# EAGLE design dcdr_3.3 (EAGLE 9.6.2)
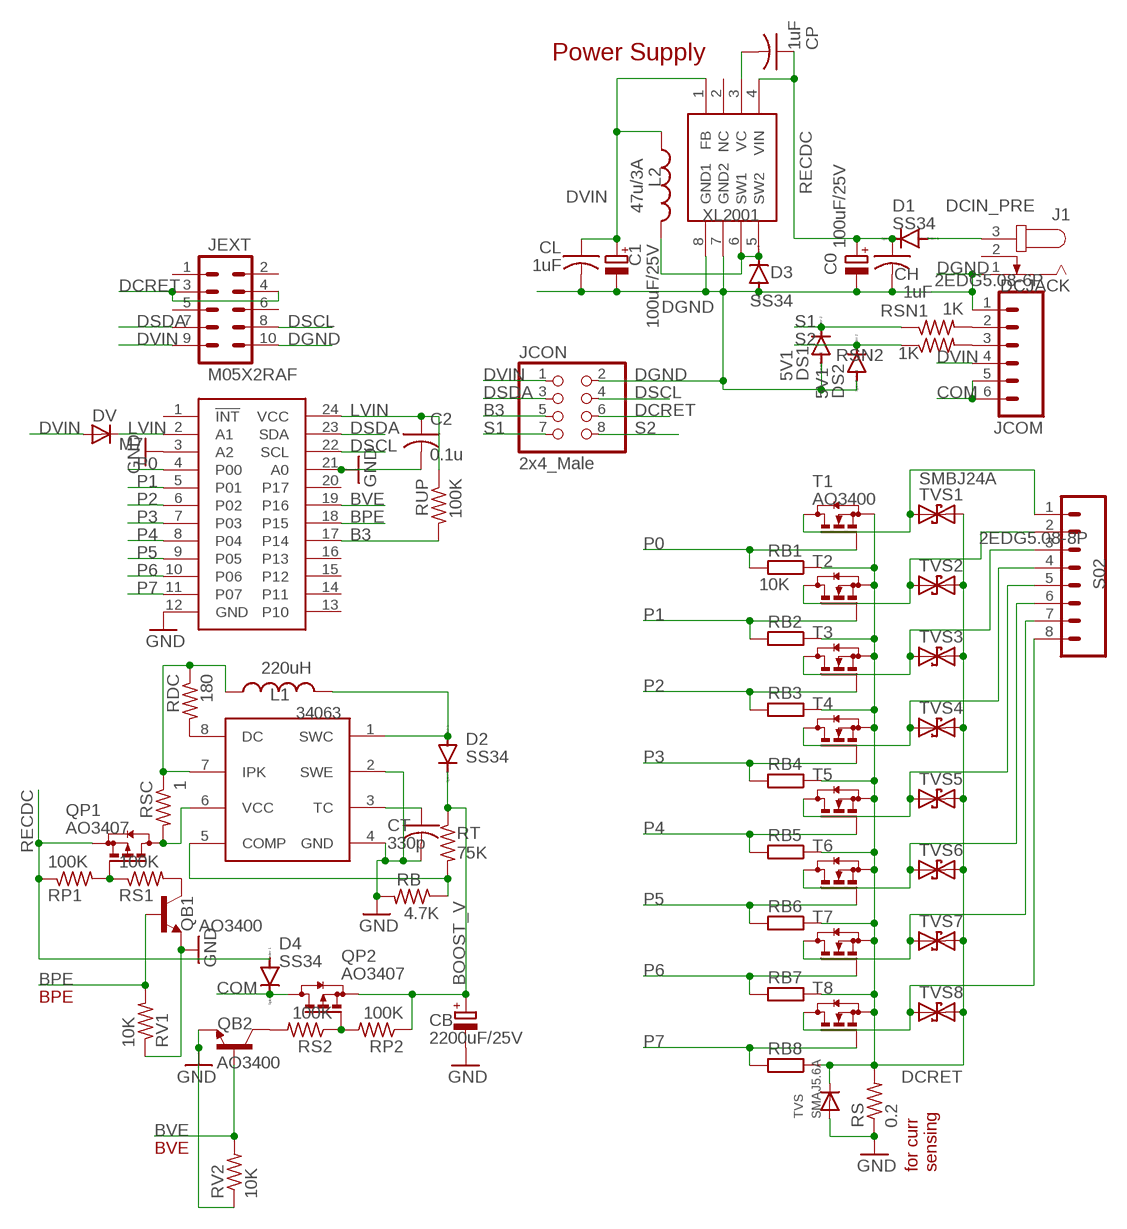
[diagram p0: schematic, sheet 1]

## Parts
34063  MC34063  MC33063/MC34063D  [SO08]
C0  100uF/25V  CPOL-EUE2-5  [E2-5]
C1  100uF/25V  CPOL-EUE2-5  [E2-5]
C2  0.1u  C-USC0603  [C0603]
CB  2200uF/25V  CPOL-EUE5-6  [E5-6]
CH  1uF  C-USC0603K  [C0603K]
CL  1uF  C-USC0603K  [C0603K]
CP  1uF  C-USC0603K  [C0603K]
CT  330p  C-USC0603K  [C0603K]
D1  SS34  DIODE-SMB  [SMB]
D2  SS34  DIODE-SMB  [SMB]
D3  SS34  DIODE-SMB  [SMB]
D4  SS34  DIODE-SMB  [SMB]
DS1  5V1  DIODE-MINIMELF  [MINIMELF]
DS2  5V1  DIODE-MINIMELF  [MINIMELF]
DV  M7  DIODESMA  [SMA-DIODE]
J1  DCJACK  JACK-PLUG0  [SPC4077]
JCOM  2EDG5.08-6P  M065MM  [SCREWTERMINAL-5MM-6]
JCON  2x4_Male  PINHD-2X4  [2X04]
JEXT  M05X2RAF  [2X5-RAF]
L1  220uH  INDUCTORCR54  [CR54]
L2  47u/3A  INDUCTORYT1014  [YT1014]
PCA9555  PCA9555  PCF8575TSSOP24  [TSSOP24]
QB1  AO3400  TRANSISTOR_NPNSOT23-3  [SOT23-3]
QB2  AO3400  TRANSISTOR_NPNSOT23-3  [SOT23-3]
QP1  AO3407  BSS84  [SOT23]
QP2  AO3407  BSS84  [SOT23]
RB  4.7K  R-US_R0603  [R0603]
RB1  10K  R-EU_R0603  [R0603]
RB2  10K  R-EU_R0603  [R0603]
RB3  10K  R-EU_R0603  [R0603]
RB4  10K  R-EU_R0603  [R0603]
RB5  10K  R-EU_R0603  [R0603]
RB6  10K  R-EU_R0603  [R0603]
RB7  10K  R-EU_R0603  [R0603]
RB8  10K  R-EU_R0603  [R0603]
RDC  180  R-US_R0603  [R0603]
RP1  100K  R-US_R0603  [R0603]
RP2  100K  R-US_R0603  [R0603]
RS  0.2  R-US_R2512  [R2512]
RS1  100K  R-US_R0603  [R0603]
RS2  100K  R-US_R0603  [R0603]
RSC  1  R-US_R0603  [R0603]
RSN1  1K  R-US_R0603  [R0603]
RSN2  1K  R-US_R0603  [R0603]
RT  75K  R-US_R0603  [R0603]
RUP  100K  R-US_R0603  [R0603]
RV1  10K  R-US_R0603  [R0603]
RV2  10K  R-US_R0603  [R0603]
S02  2EDG5.08-8P  M085MM-8  [SCREWTERMINAL-5MM-8]
T1  AO3400  BSS123  [SOT23]
T2  AO3400  BSS123  [SOT23]
T3  AO3400  BSS123  [SOT23]
T4  AO3400  BSS123  [SOT23]
T5  AO3400  BSS123  [SOT23]
T6  AO3400  BSS123  [SOT23]
T7  AO3400  BSS123  [SOT23]
T8  AO3400  BSS123  [SOT23]
TVS  SMAJ5.6A  DIODESMA  [SMADIODE]
TVS1  SMBJ24A  TVSSMB  [SMB]
TVS2  SMBJ24A  TVSSMB  [SMB]
TVS3  SMBJ24A  TVSSMB  [SMB]
TVS4  SMBJ24A  TVSSMB  [SMB]
TVS5  SMBJ24A  TVSSMB  [SMB]
TVS6  SMBJ24A  TVSSMB  [SMB]
TVS7  SMBJ24A  TVSSMB  [SMB]
TVS8  SMBJ24A  TVSSMB  [SMB]
XL2001  XL2001  [SO08]

## Nets
B3: JCON.5 PCA9555.17(P14) RUP.2
BOOST_V: CB.+ D2.C QP2.2(S) RP2.1 RT.1
BPE: PCA9555.18(P15) QB1.1(B) RV1.2
BVE: PCA9555.19(P16) QB2.1(B) RV2.2
COM [power]: D4.C JCOM.5 JCOM.6 QP2.3(D)
DCIN_PRE: D1.A J1.3
DCRET: JCON.6 JEXT.3 JEXT.4 RB1.1 RB2.1 RB3.1 RB4.1 RB5.1 RB6.1 RB7.1 RB8.1 RS.2 T1.2(S) T2.2(S) T3.2(S) T4.2(S) T5.2(S) T6.2(S) T7.2(S) T8.2(S) TVS1.C TVS2.C TVS3.C TVS4.C TVS5.C TVS6.C TVS7.C TVS8.C TVS.C
DGND [power]: 34063.2(SWE) 34063.4(GND) C0.- C1.- C2.2 CB.- CH.2 CL.2 CT.2 D3.A DS1.A DS2.A J1.1 JCOM.1 JCON.2 JEXT.10 PCA9555.3(A2) PCA9555.12(GND) PCA9555.21(A0) QB1.2(E) QB2.2(E) RB.2 RS.1 RV1.1 RV2.1 TVS.A XL2001.7(GND2) XL2001.8(GND1) ; supply symbol labelled GND
DSCL [i2c]: JCON.4 JEXT.8 PCA9555.22(SCL)
DSDA [i2c]: JCON.3 JEXT.7 PCA9555.23(SDA)
DVIN [power]: C1.+ CL.1 DV.A JCOM.4 JCON.1 JEXT.9 L2.P$2 XL2001.1(FB)
LVIN [power]: C2.1 DV.C PCA9555.2(A1) PCA9555.24(VCC) RUP.1
N$1: 34063.1(SWC) D2.A L1.P$2
N$2: JCOM.2 RSN1.2
N$3: JCOM.3 RSN2.2
N$4: D3.C L2.P$1 XL2001.5(SW2) XL2001.6(SW1)
N$17: 34063.3(TC) CT.1
N$24: 34063.8(DC) RDC.2
N$25: CP.2 XL2001.3(VC)
N$26: 34063.7(IPK) L1.P$1 RDC.1 RSC.1
N$27: 34063.6(VCC) QP1.3(D) RSC.2
N$29: 34063.5(COMP) RB.1 RT.2
N$30: QP1.1(G) RP1.2 RS1.1
N$34: QB2.3(C) RS2.2
N$35: QB1.3(C) RS1.2
N$38: QP2.1(G) RP2.2 RS2.1
N$50 [power]: S02.1 T1.3(D) TVS1.A
N$51 [power]: S02.2 T2.3(D) TVS2.A
N$52 [power]: S02.3 T3.3(D) TVS3.A
N$53 [power]: S02.4 T4.3(D) TVS4.A
N$54 [power]: S02.5 T5.3(D) TVS5.A
N$55 [power]: S02.6 T6.3(D) TVS6.A
N$56 [power]: S02.7 T7.3(D) TVS7.A
N$57 [power]: S02.8 T8.3(D) TVS8.A
P0: PCA9555.4(P00) RB1.2 T1.1(G)
P1: PCA9555.5(P01) RB2.2 T2.1(G)
P2: PCA9555.6(P02) RB3.2 T3.1(G)
P3: PCA9555.7(P03) RB4.2 T4.1(G)
P4: PCA9555.8(P04) RB5.2 T5.1(G)
P5: PCA9555.9(P05) RB6.2 T6.1(G)
P6: PCA9555.10(P06) RB7.2 T7.1(G)
P7: PCA9555.11(P07) RB8.2 T8.1(G)
RECDC [power]: C0.+ CH.1 CP.1 D1.C D4.A QP1.2(S) RP1.1 XL2001.4(VIN)
S1 [i2c]: DS1.C JCON.7 RSN1.1
S2 [i2c]: DS2.C JCON.8 RSN2.1
Unconnected: J1.2 JEXT.1 JEXT.2 JEXT.5 JEXT.6 PCA9555.1(!INT) PCA9555.13(P10) PCA9555.14(P11) PCA9555.15(P12) PCA9555.16(P13) PCA9555.20(P17) XL2001.2(NC)

## Notes on the sheet
- Power Supply
- BPE
- BVE
- for curr
  sensing

## Library data of the parts
34063 = adafruit:MC33063/MC34063: MC33063 and MC34063 Basic DC/DC converter with internal power-NPN transistor, 100KHz, 1.5A peak switch current. 3-40 input/output.
C0 C1 CB = rcl:CPOL-EU: POLARIZED CAPACITOR, European symbol; SPICEPREFIX: C
C2 CH CL CP CT = adafruit:C-US: CAPACITOR, American symbol
D1-D4 = diode:DIODE-: DIODE
DS1 DS2 = diode@1:DIODE-: DIODE
DV = SparkFun:DIODE: Diode
J1 = jacks:JACK-PLUG: DC POWER JACK Power Jack, DC, Right Angle, Through Hole, Rated 5A at 16VDC, PC Terminals Distributor: Farnell (www.Farnell.de) Drawing: 84N1161.pdf / 84N1162.pdf Manufacturer: SPC Technology (www.spctechnology.com) Type: SPC4077 / SPC 4078; OC_FARNELL: unknown; OC_NEWARK: unknown
JCOM = SparkFun:M06: Header 6 Standard 6-pin 0.1" header. Use with straight break away headers (SKU : PRT-00116), right angle break away headers (PRT-00553), swiss pins (PRT-00743), machine pins (PRT-00117), and female headers (PRT-00115). Molex polarized connector foot print use with SKU : PRT-08094 with associated crimp pins and housings. NOTES ON THE VARIANTS LOCK and LOCK_LONGPADS... This footprint was designed to help hold the alignment of a through-hole component (i.e. 6-pin header) while soldering it into place. You may notice that each hole has been shifted either up or down by 0.005 of an inch from it's more standard position (which is a perfectly straight line). This slight alteration caused the pins (the squares in the middle) to touch the edges of the holes. Because they are alternating, it causes a "brace" to hold the component in place. 0.005 has proven to be the perfect amount of "off-center" position when using our standard breakaway headers. Although looks a little odd when you look at the bare footprint, once you have a header in there, the alteration is very hard to notice. Also, if you push a header all the way into place, it is covered up entirely on the bottom side. This idea of altering the position of holes to aid alignment will be further integrated into the Sparkfun Library for other footprints. It can help hold any component with 3 or more connection pins.
JCON = adafruit_3:PINHD-2X4: PIN HEADER
JEXT = SparkFunNew:M05X2: Header 5x2 Standard 10-pin dual row 0.1" header. Commonly used with AVR-ISP. Use with Spark Fun Electronics SKU: PRT-00778
L1 L2 = SparkFunNew:INDUCTOR: Inductors Basic Inductor/Choke - 0603 and 1206. Footprints are not proven and vary greatly between part numbers.
PCA9555 = SparkFunNew:PCF8575
QB1 QB2 = SparkFunNew:TRANSISTOR_NPN: Transistor NPN BJT configuration in SOT23 package. MMBT2222 is the common NPN we use. Double check BCE configuration again layout.
QP1 QP2 = transistors:BSS84: P-CHANNEL MOS FET
RB RDC RP1 RP2 RS1 RS2 RSC RT RUP RV1 RV2 = adafruitGood:R-US_: RESISTOR, American symbol
RB1-RB8 = rcl:R-EU_: RESISTOR, European symbol; SPICEPREFIX: R
RS = adafruit:R-US_: RESISTOR, American symbol
RSN1 RSN2 = adafruit2013:R-US_: RESISTOR, American symbol
S02 = SparkFun:M08: Header 8 Standard 8-pin 0.1" header. Use with straight break away headers (SKU : PRT-00116), right angle break away headers (PRT-00553), swiss pins (PRT-00743), machine pins (PRT-00117), and female headers (PRT-00115).
T1-T8 = transistors:BSS123: N-CHANNEL MOS FET
TVS = adafruit:DIODE: Diode
TVS1-TVS8 = SparkFunNew:TVS
XL2001 = adafruit:XL2001

## Net classes
0 default: width 0.203 mm, clearance 0.178 mm
1 power: width 0.203 mm, clearance 0.178 mm
2 relaypower: width 0.203 mm, clearance 0.178 mm
3 signal: width 0.203 mm, clearance 0.178 mm
4 adc: width 0.406 mm, clearance 0.178 mm
5 i2c: width 0.305 mm, clearance 0.178 mm

## Board
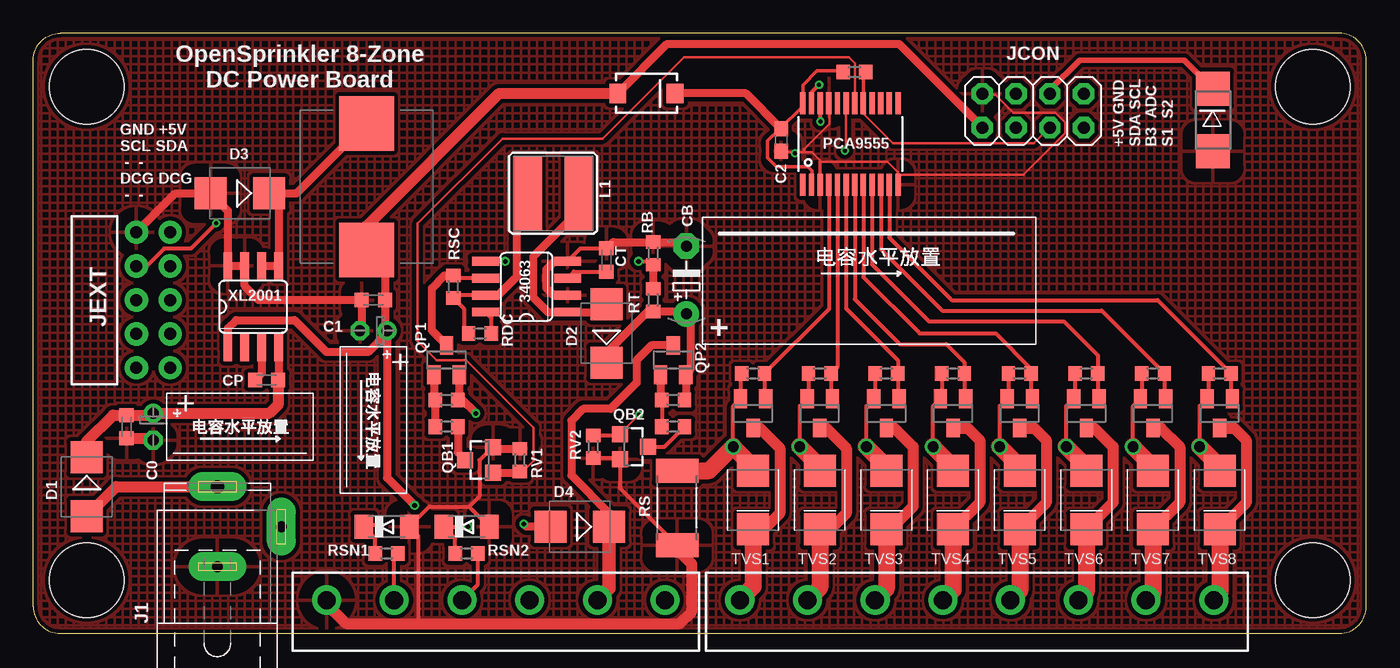
[diagram p1: board, top side]
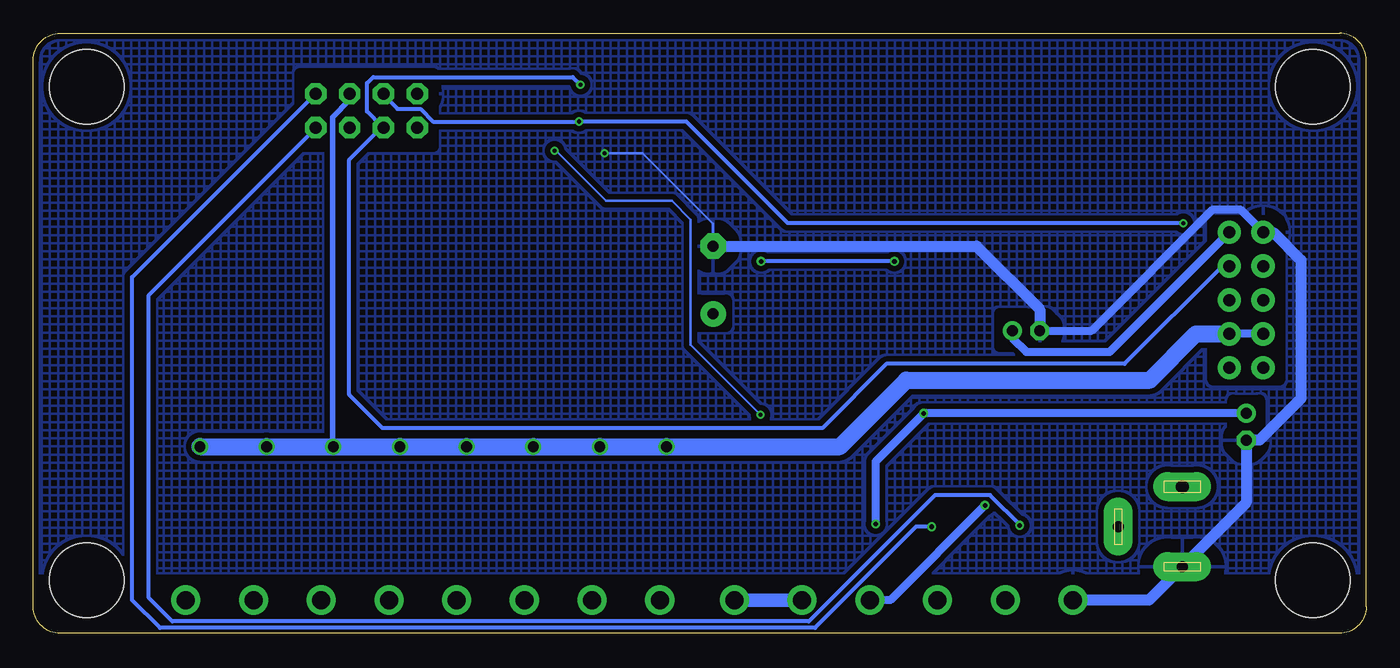
[diagram p2: board, bottom side, seen from below]

Size 100 x 45 mm. Coordinates in mm from the lower left corner, seen from the top.
Outline: 2,0 98,0 arc90 100,2 100,43 arc90 98,45 2,45 arc90 0,43 0,2 arc90 2,0
Copper layers (1*16): Top 0.035mm / dielectric 1.5mm / Bottom 0.035mm
Design rules "Fusion_eagle_rule_v1.1 *": minimum track width 6mil, minimum drill 12mil, track to track 6mil, track to pad 6mil, pad to pad 6mil, via to via 6mil, smd to smd 0mil, copper to edge 10mil, drill to drill 10mil, minimum pad ring 10mil, minimum via ring 6mil, stop-mask expansion 2mil, vias tented up to drill 100mil, thermal gap 40mil
Holes 5.6 mm at 4,4 96,4 4,41 96,41
bRestrict: area 70,36.5 to 80,42; area 6.5,19 to 11.5,31; area 48,23 to 50,25; area 8,15.5 to 10,17.5; area 25.5,21.5 to 27.5,24

### Footprints (pad centres in the part's own frame; a part is rotated, then mirrored left to right if it is on the bottom)
SO08 = smd 0.66 x 2.032: 1 -1.905,-3.073; 2 -0.635,-3.073; 3 0.635,-3.073; 4 1.905,-3.073; 5 1.905,3.073; 6 0.635,3.073; 7 -0.635,3.073; 8 -1.905,3.073
E2-5 = drill 0.813 pad 1.422: + -1.016,0 | drill 0.813 pad 1.422 octagon: - 1.016,0
C0603 = smd 1.1 x 1: 1 -0.85,0; 2 0.85,0
E5-6 = drill 0.813 pad 1.905: + -2.54,0 | drill 0.813 pad 1.905 octagon: - 2.54,0
C0603K = smd 1.05 x 1.08: 1 -0.875,0; 2 0.875,0
SMB = smd 2.4 x 2.4: A 2.2,0; C -2.2,0
MINIMELF = smd 1.4 x 1.8: A 1.7,0; C -1.7,0
SMA-DIODE = smd 1.27 x 1.47: A -2.15,0; C 2.15,0
SPC4077 = drill 0.8 pad 2.184 long: 1 -3,0; 2 0,-4.8 | drill 1 pad 2.184 long: 3 3,0
SCREWTERMINAL-5MM-6 = drill 1.35 pad 2.184: 1 0,0; 2 5.08,0; 3 10.16,0; 4 15.24,0; 5 20.32,0; 6 25.4,0
2X04 = drill 0.9 pad 1.6 octagon: 1 -3.81,-1.27; 2 -3.81,1.27; 3 -1.27,-1.27; 4 -1.27,1.27; 5 1.27,-1.27; 6 1.27,1.27; 7 3.81,-1.27; 8 3.81,1.27
2X5-RAF = drill 0.9 pad 1.75: 1 5.08,1.27; 2 5.08,-1.27; 3 2.54,1.27; 4 2.54,-1.27; 5 0,1.27; 6 0,-1.27; 7 -2.54,1.27; 8 -2.54,-1.27; 9 -5.08,1.27; 10 -5.08,-1.27
CR54 = smd 5.5 x 2.15: P$1 0,1.92; P$2 0,-1.92
YT1014 = smd 4.1 x 4.1: P$1 -4.75,0; P$2 4.75,0
TSSOP24 = smd 0.4 x 1.65: 1 -3.575,-3.05; 2 -2.925,-3.05; 3 -2.275,-3.05; 4 -1.625,-3.05; 5 -0.975,-3.05; 6 -0.325,-3.05; 7 0.325,-3.05; 8 0.975,-3.05; 9 1.625,-3.05; 10 2.275,-3.05; 11 2.925,-3.05; 12 3.575,-3.05; 13 3.575,3.05; 14 2.925,3.05; 15 2.275,3.05; 16 1.625,3.05; 17 0.975,3.05; 18 0.325,3.05; 19 -0.325,3.05; 20 -0.975,3.05; 21 -1.625,3.05; 22 -2.275,3.05; 23 -2.925,3.05; 24 -3.575,3.05
SOT23-3 = smd 1.2 x 1.2: 1 1,-0.95; 2 1,0.95; 3 -1.1,0
SOT23 = smd 1.4 x 1: 1 1.1,-0.95; 2 1.1,0.95; 3 -1.1,0
R0603 = smd 1 x 1.1: 1 -0.85,0; 2 0.85,0
R2512 = smd 1.8 x 3.2: 1 -2.8,0; 2 2.8,0
SCREWTERMINAL-5MM-8 = drill 1.35 pad 2.184: 1 0,0; 2 5.08,0; 3 10.16,0; 4 15.24,0; 5 20.32,0; 6 25.4,0; 7 30.48,0; 8 35.56,0
SMADIODE = smd 2.54 x 2.54: A 2.349,0; C -2.349,0

### Placement (x,y rotation side)
34063  37,26 90 top
C0  9,15.5 270 top
C1  25.52,22.7 180 top
C2  56.1,37 270 top
CB  49,26.5 90 top
CH  7,15.5 270 top
CL  25.5,25 180 top
CP  17.5,19 180 top
CT  43,28 90 top
D1  4,11 270 top
D2  43,22.5 90 top
D3  15.5,33 180 top
D4  41,8 180 top
DS1  26.5,8 0 top
DS2  32.5,8 0 top
DV  46,40.5 0 top
J1  13.8,8 90 top
JCOM  22,2.5 0 top
JCON  75,39.2 0 top
JEXT  9,25 270 top
L1  39,33 90 top
L2  25,33.5 270 top
PCA9555  61.3,36.7 0 top
QB1  33.5,13 0 top
QB2  45,14 180 top
QP1  31,20.5 270 top
QP2  48,20.5 270 top
RB  46.5,28.5 90 top
RB1  54,19.5 0 top
RB2  59,19.5 0 top
RB3  64,19.5 0 top
RB4  69,19.5 0 top
RB5  74,19.5 0 top
RB6  79,19.5 0 top
RB7  84,19.5 0 top
RB8  89,19.5 0 top
RDC  33.5,22.5 0 top
RP1  31,17.5 180 top
RP2  48,17.5 180 top
RS  48.3,9.4 90 top
RS1  31,15.5 0 top
RS2  48,15.5 0 top
RSC  31.5,26 90 top
RSN1  26.5,6 0 top
RSN2  32.5,6 0 top
RT  46.5,25 90 top
RUP  61.6,42.1 0 top
RV1  36.5,13 270 top
RV2  42,14 90 top
S02  53,2.5 0 top
T1  54,16.5 90 top
T2  59,16.5 90 top
T3  64,16.5 90 top
T4  69,16.5 90 top
T5  74,16.5 90 top
T6  79,16.5 90 top
T7  84,16.5 90 top
T8  89,16.5 90 top
TVS  88.5,38.5 270 top
TVS1  54,10 270 top
TVS2  59,10 270 top
TVS3  64,10 270 top
TVS4  69,10 270 top
TVS5  74,10 270 top
TVS6  79,10 270 top
TVS7  84,10 270 top
TVS8  89,10 270 top
XL2001  16.5,24.5 0 top

### Tracks (layer width: path | path; a pad name or v marks a point on that pad's centre or on a via)
B3
  Top 0.203: 62.51,42.06 RUP.2 | PCA9555.17 62.29,39.72 62.29,38.96 64.48,36.77 75.06,36.77 76.2,37.91 JCON.5
  Top 0.254: PCA9555.17 62.27,41.82 62.51,42.06
BOOST_V
  Top 0.61: D2.C 43,21.05 46.1,24.15 RT.1 48.81,24.15 CB.+ 49.3,23.66 49.3,19.75 QP2.2 48.95,17.6 RP2.1
BPE
  Top 0.203: RV1.2 36.74,12.15 37.54,12.95 37.54,15.42 32.48,20.48 30.27,20.48 28.84,21.91 28.84,30.74 35.2,37.1 42.7,37.1 48.8,43.2 61.2,43.2 61.62,42.77 PCA9555.18
  Top 0.61: QB1.1 36.4,12.05 RV1.2
BVE  (via drill 0.3)
  Top 0.203: v45.45,16.4 44.1,15.05 QB2.1 | v60.88,36.19 60.98,36.28 PCA9555.19
  Top 0.305: RV2.2 43.9,14.85 QB2.1
  Bottom 0.203: v60.88,36.19 60.8,36.19 57.04,32.43 52.09,32.43 50.69,31.04 50.69,21.64 v45.45,16.4
COM
  Top 0.61: QP2.3 46.37,21.6 45.27,20.5 45.27,18.79 43.31,16.83 41.25,16.83 40.37,15.95 40.37,11.85 43.2,9.02 D4.C
  Top 1.016: D4.C 43.2,3.38 JCOM.5
  Bottom 1.016: JCOM.5 JCOM.6
DCIN_PRE
  Top 0.813: D1.A 6.2,11 J1.3
DCRET  (via drill 0.8)
  Top 0.305: RB1.1 53.05,19.4 T1.2 52.5,17.05 v52.5,14 | RB2.1 58.15,17.7 T2.2 57.5,17.05 v57.5,14 | RB3.1 63.15,17.7 T3.2 62.5,17.05 v62.5,14 | RB4.1 68.15,17.7 T4.2 67.5,17.05 v67.5,14 | RB5.1 73.15,17.7 T5.2 72.5,17.05 v72.5,14 | RB6.1 78.15,17.7 T6.2 77.5,17.05 v77.5,14 | RB7.1 83.15,17.7 T7.2 82.5,17.05 v82.5,14 | RB8.1 88.15,17.7 T8.2 87.5,17.05 v87.5,14
  Top 0.406: JCON.6 76.27,40.77 78.5,43 86.35,43 TVS.C
  Top 1.27: TVS1.C 54,12.5 v52.5,14 50.7,12.2 RS.2 | TVS2.C 59,12.5 v57.5,14 | v62.5,14 64,12.5 TVS3.C | TVS4.C 69,12.5 v67.5,14 | v72.5,14 74,12.5 TVS5.C | TVS6.C 79,12.5 v77.5,14 | v82.5,14 84,12.5 TVS7.C | TVS8.C 89,12.5 v87.5,14
  Bottom 0.406: JCON.6 76.27,40 77.55,38.72 77.55,14
  Bottom 0.61: JEXT.4 JEXT.3
  Bottom 1.27: v87.5,14 v82.5,14 v77.5,14 | 77.55,14 v77.5,14 | v77.5,14 v72.5,14 v67.5,14 v62.5,14 v57.5,14 v52.5,14 39.5,14 34.5,19 16.23,19 12.77,22.46 JEXT.3
DGND  (via drill 0.3)
  Top 0.203: CT.2 43.01,28.86 43.12,28.98 | 57.82,36.1 58.4,36.1 59.02,35.48 59.02,35.37 64.08,35.37 64.86,34.59 64.86,33.72 PCA9555.12 64.96,34.38 74.3,34.38 77.44,37.53 77.44,38.29 76.68,39.05 73.53,39.05 72.2,40.39 71.25,40.39 JCON.2 | 57.82,36.1 57.15,36.1 | 57.15,36.1 56.1,36.1 C2.2 | PCA9555.21 59.72,39.72 59.72,38.2 57.82,36.3 57.82,36.1 | v57.15,36.01 57.15,36.1
  Top 0.254: PCA9555.3 59.02,35.37
  Top 0.305: 32.7,9.5 DS2.A | 32.7,9.5 29.7,9.5 DS1.A 28.9,7.3 28.9,2.31 28.9,0.72 | 32.7,9.5 33.47,10.27 33.47,12.99 34.43,13.95 QB1.2 | RV2.1 43.9,13.15 QB2.2 44,10.9 RS.1 | 34063.4 41.04,28.88 CT.2
  Top 0.406: 34063.2 39.03,25.36 | 39.1,27.91 34063.4 | 48.69,29.35 CB.-
  Top 0.61: C1.- 24.62,22.82 CL.2 16.9,25 15.87,26.04 XL2001.7 XL2001.8 14.6,31.7 D3.A 10.65,33 JEXT.10 | QB1.2 34.6,13.85 RV1.1 | 39.03,25.36 38.5,25.9 38.5,27.3 39.1,27.91 | 43.12,28.98 43.5,29.35 RB.2 48.69,29.35
  Top 0.813: CH.2 8.86,14.62 C0.- | JCOM.1 22,2.2 23.48,0.72 28.9,0.72 48.49,0.72 49.4,1.63 49.4,5.2 48.3,6.3 RS.1
  Bottom 0.203: v57.15,36.01 54.3,36.01 49,30.7 CB.-
  Bottom 0.61: C1.- 20.6,22.7 11.5,31.8 9.45,31.8 JEXT.10
  Bottom 0.813: JCOM.1 16.3,2.5 J1.1 9,9.8 C0.- 8.02,14.48 4.9,17.6 4.9,28 6.98,30.08 JEXT.10 | CB.- 29.24,29.04 24.5,24.3 C1.-
  pour Top (isolate 0.305, hatched): 0,45 100,45 100,0 0,0
  pour Bottom (isolate 0.406, hatched): 0,45 100,45 100,4.5 0,4.5
DSCL  (via drill 0.3)
  Top 0.305: v59.05,38.39 59.05,39.72 PCA9555.22 | v13.72,30.77 11.81,28.86 9.81,28.86 8.57,27.62 7.81,27.62 JEXT.8
  Bottom 0.305: JCON.4 73.72,40.39 72.68,39.34 70.96,39.34 70.01,38.39 v59.05,38.39 51.01,38.39 43.39,30.77 v13.72,30.77
DSDA  (via drill 0.3)
  Top 0.305: v58.96,41.15 58.39,40.58 58.39,39.81 PCA9555.23
  Bottom 0.305: v58.96,41.15 59.54,41.72 74.5,41.72 74.97,41.26 74.97,39.15 73.82,38.01 | 73.82,38.01 JCON.3 | JEXT.7 10.29,27.53 10.81,27.53 18.13,20.2 36,20.2 40.8,15.4 73.8,15.4 76.3,17.9 76.3,35.52 73.82,38.01
DVIN  (via drill 0.35)
  Top 0.203: 71.15,38.01 JCON.1
  Top 0.61: L2.P$2 26.38,27.38 CL.1 26.38,22.86 C1.+ | C1.+ 26.53,22.53 25.1,21.1 22,21.1 19.6,23.5 15.2,23.5 14.6,22.89 XL2001.1 | C1.+ 26.53,11.67 v28.6,9.6 | 71.15,38.01 64.95,44.21 47.56,44.21 DV.A
  Top 0.813: L2.P$2 25,30.55 34.95,40.5 DV.A
  Bottom 0.61: C1.+ 26.53,22.14 25.49,21.11 19.24,21.11 JEXT.9 | v28.6,9.6 35.7,2.5 JCOM.4
LVIN
  Top 0.203: 57.63,39.43 PCA9555.24
  Top 0.254: PCA9555.24 57.73,41.12 58.8,42.2 60.65,42.2 RUP.1 | PCA9555.2 58.4,33.67 58.4,34.7 58.1,34.99 55.77,34.99 55.09,35.67 55.09,36.93 56.02,37.85 C2.1 56.1,37.91 57.63,39.43
  Top 0.61: DV.C 53.45,40.5 C2.1
N$1
  Top 0.406: L1.P$2 40.54,32.62 40.54,31.29 | 42.4,24.09 D2.A
  Top 0.61: 40.54,31.29 37.5,28.26 37.5,25.2 38.6,24.09 34063.1 42.4,24.09
N$2
  Top 0.305: JCOM.2 27.08,5.73 RSN1.2
N$3
  Top 0.305: JCOM.3 33.35,3.69 RSN2.2
N$4
  Top 0.61: XL2001.6 XL2001.5 18.41,32.3 D3.C 19.75,33 L2.P$1
N$17
  Top 0.305: 34063.3 40.56,27.12 CT.1
N$24
  Top 0.305: 34063.8 34.35,23.67 RDC.2
N$25
  Top 0.61: XL2001.3 17.14,19.51 CP.2
N$26
  Top 0.305: 34063.7 31.71,25.36 RSC.1 32.3,24.35 32.3,22.85 RDC.1
  Top 0.406: 34063.7 34.87,25.36 | 36.3,32.6 36.7,33 L1.P$1
  Top 0.61: 36.3,32.6 36.3,26.8 34.87,25.36
N$27
  Top 0.305: 34063.6 31.71,26.64 RSC.2
  Top 0.61: QP1.3 29.9,22.7 29.9,25.9 30.85,26.85 RSC.2
N$29  (via drill 0.35)
  Top 0.305: 34063.5 v35.4,27.9 | v45.4,27.9 46.25,27.9 RB.1
  Top 0.61: RB.1 RT.2
  Bottom 0.305: v35.4,27.9 v45.4,27.9
N$30
  Top 0.61: QP1.1 30.05,17.6 RP1.2 RS1.1
N$34
  Top 0.305: QB2.3 47.35,14 RS2.2
N$35
  Top 0.61: RS1.2 31.85,13.55 QB1.3
N$38
  Top 0.305: RP2.2 RS2.1
  Top 0.61: QP2.1 47.05,17.6 RP2.2
N$50
  Top 0.813: T1.3 54.5,15.4 56,13.9 56,9 54.8,7.8 TVS1.A
  Top 1.27: TVS1.A 54,3.5 S02.1
N$51
  Top 0.813: T2.3 59.5,15.4 61,13.9 61,9 59.8,7.8 TVS2.A
  Top 1.27: TVS2.A 59,3.42 S02.2
N$52
  Top 0.813: T3.3 64.6,15.4 66,14 66,9.5 64.3,7.8 TVS3.A
  Top 1.27: TVS3.A 64,3.34 S02.3
N$53
  Top 0.813: T4.3 70.1,15.4 71,14.5 71,9.8 TVS4.A
  Top 1.27: TVS4.A 69,3.26 S02.4
N$54
  Top 0.813: T5.3 75.1,15.4 76,14.5 76,9.8 TVS5.A
  Top 1.27: TVS5.A 74,3.18 S02.5
N$55
  Top 0.813: T6.3 79.6,15.4 81,14 81,9.8 TVS6.A
  Top 1.27: TVS6.A 79,3.1 S02.6
N$56
  Top 0.813: T7.3 84.6,15.4 86,14 86,9.8 TVS7.A
  Top 1.27: TVS7.A 84,3.02 S02.7
N$57
  Top 0.813: T8.3 90.1,15.4 91,14.5 91,9.8 TVS8.A
  Top 1.27: TVS8.A 89,2.94 S02.8
P0
  Top 0.305: T1.1 54.85,17.7 RB1.2 59.67,24.32 PCA9555.4
P1
  Top 0.305: T2.1 59.85,17.7 RB2.2 60.33,19.98 PCA9555.5
P2
  Top 0.305: PCA9555.6 60.98,24.38 64.85,20.5 RB3.2 64.85,17.7 T3.1
P3
  Top 0.305: PCA9555.7 61.62,25.07 65,21.7 68.5,21.7 69.85,20.35 RB4.2 69.85,17.7 T4.1
P4
  Top 0.305: PCA9555.8 62.27,26.73 66.5,22.5 72.2,22.5 74.85,19.85 RB5.2 74.85,17.7 T5.1
P5
  Top 0.305: T6.1 79.85,17.7 RB6.2 79.85,20.85 77.3,23.4 67.2,23.4 62.92,27.68 PCA9555.9
P6
  Top 0.305: T7.1 84.85,17.7 RB7.2 80.15,24.2 68.2,24.2 63.58,28.82 PCA9555.10
P7
  Top 0.305: T8.1 89.85,17.7 RB8.2 84.35,25 68.9,25 64.22,29.68 PCA9555.11
RECDC  (via drill 0.35)
  Top 0.61: XL2001.4 18.41,19.03 CP.1 | QP1.2 31.95,17.6 | 31.95,17.6 RP1.1 | v33.2,16.5 32.1,17.6 31.95,17.6 | D4.A 37,8 v36.8,8.2
  Top 0.813: D1.C 4,14.4 5.97,16.38 CH.1 8.86,16.38 C0.+ 17.72,16.52 18.4,17.2 18.4,18.98 CP.1
  Bottom 0.61: C0.+ 33.18,16.52 v33.2,16.5 36.8,12.9 v36.8,8.2
S1  (via drill 0.35)
  Top 0.305: RSN1.1 25.65,7.15 DS1.C 24.9,8.1 v26,8.1
  Bottom 0.305: v26,8.1 26,8.13 28.23,10.36 32.35,10.36 41.81,0.9 89.57,0.9 91.33,2.66 91.33,25.37 78.81,37.89 JCON.7
S2  (via drill 0.35)
  Top 0.305: RSN2.1 31.65,7.15 DS2.C v32.6,8
  Bottom 0.305: v32.6,8 32.62,8.02 33.73,8.02 41.34,0.41 90.5,0.41 92.59,2.5 92.59,26.71 78.83,40.47 JCON.8

### Text on the board
tPlace: + | + | +
tNames: OpenSprinkler 8-Zone / DC Power Board | +5V GND / SDA SCL / B3 ADC / S1 S2 | GND +5V / SCL SDA / - - / DCG DCG / - -